# Altium schematic sheet water_level_binary.SchDoc
size A4
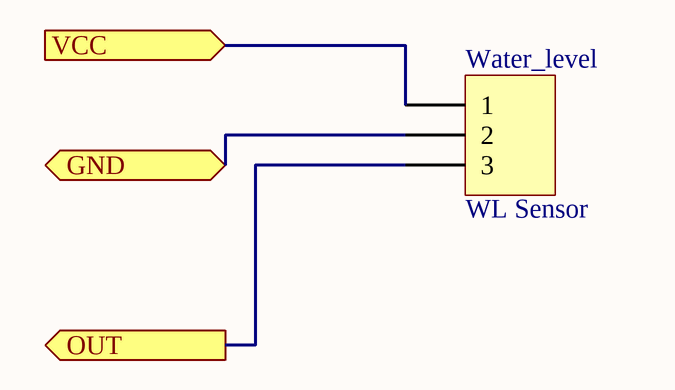
[diagram p0: water_level_binary.SchDoc]

## Parts
Water_level  WL Sensor  [3_channel_terminal_block]

## Ports
GND (bidir), OUT (out), VCC (in)

## Nets
GND: Water_level.2 ; port GND
OUT: Water_level.3 ; port OUT
VCC: Water_level.1 ; port VCC

## Library data of the parts
Water_level = Header 3: Header, 3-Pin; LatestRevisionDate: 17-Jul-2002; LatestRevisionNote: Re-released for DXP Platform.; Publisher: Altium Limited